# EAGLE design Qwiic Fuel Gauge - MAX17048 (EAGLE 9.6.2)
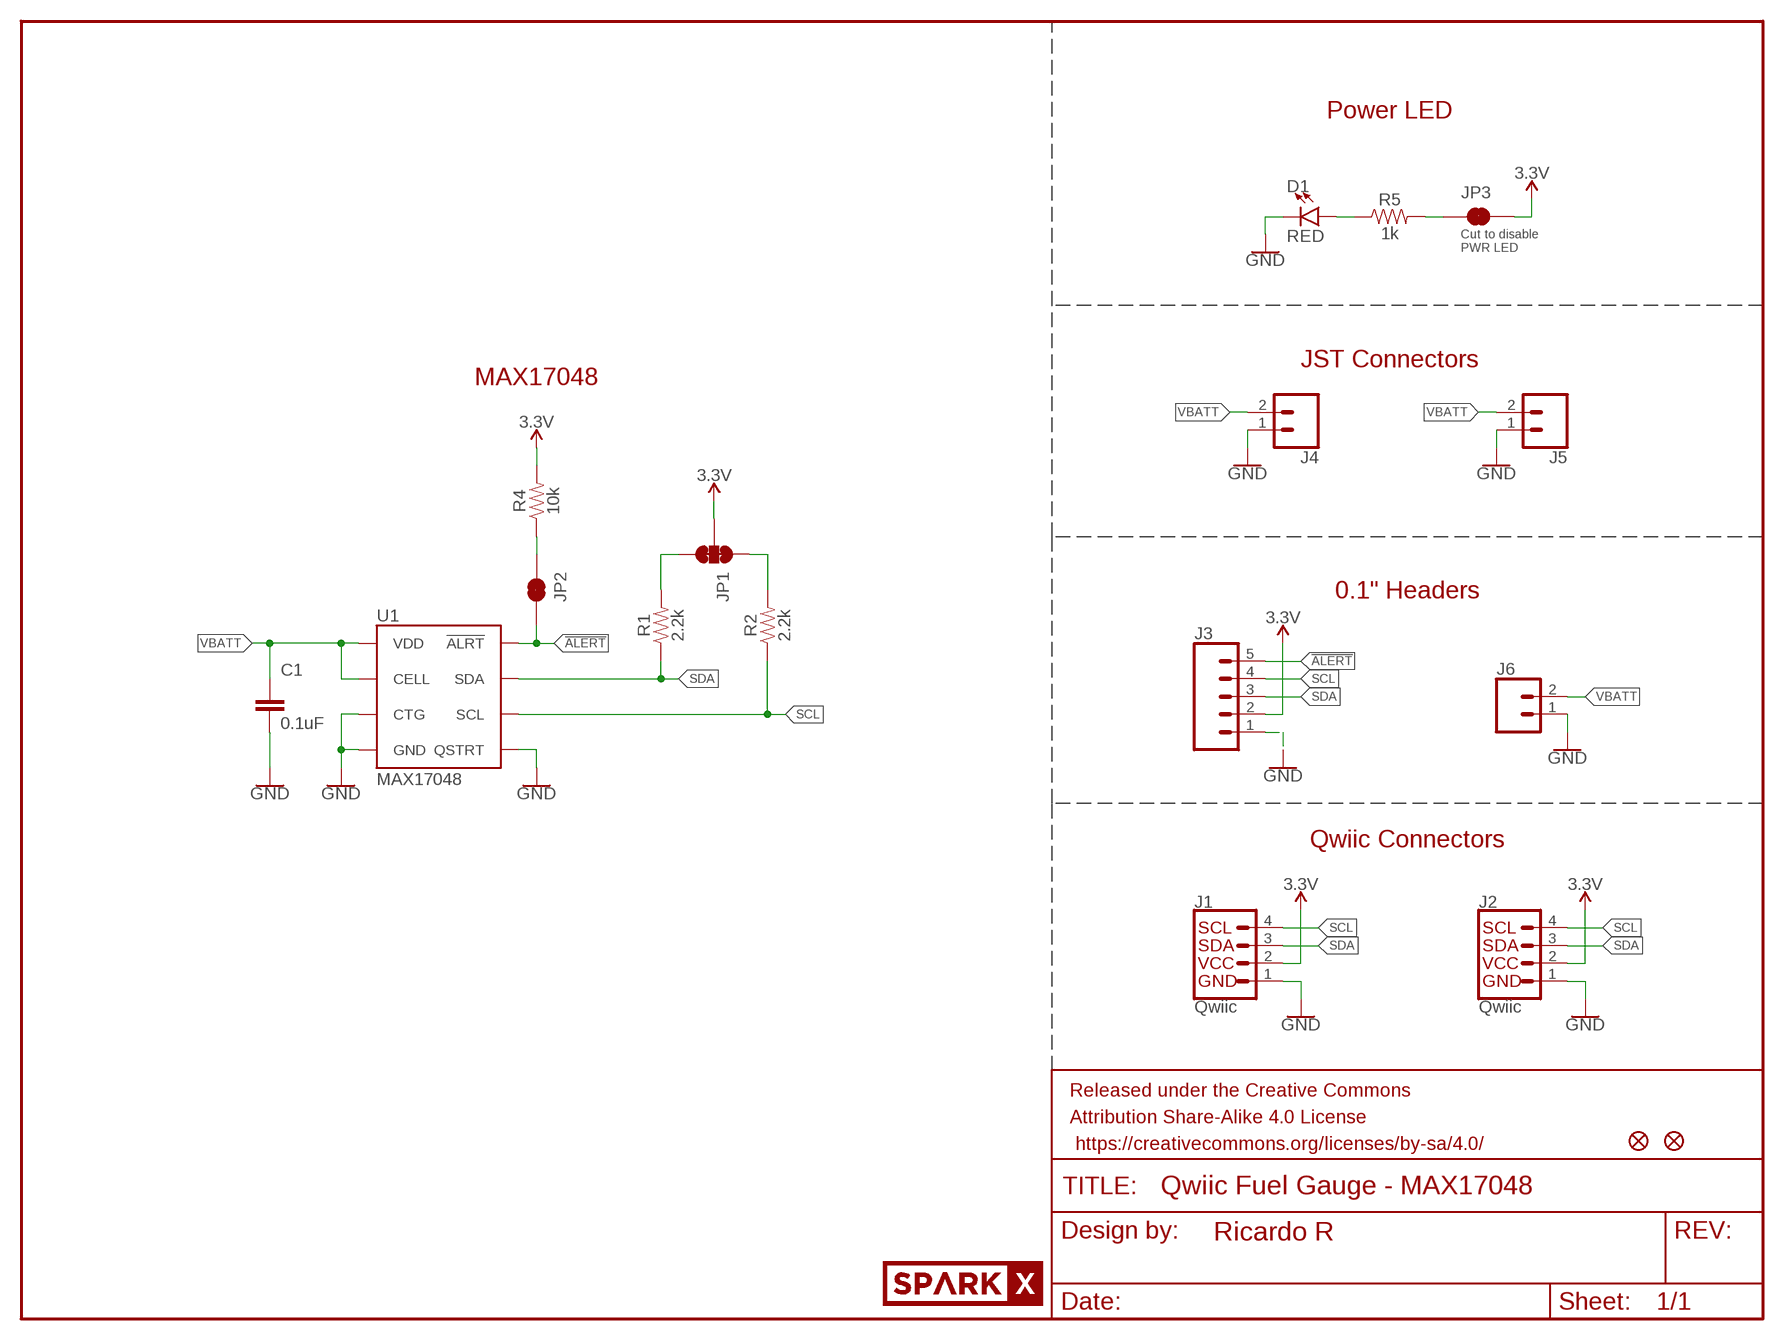
[diagram p0: schematic, sheet 1]

## Parts
C1  0.1uF  0.1UF-0603-25V-(+80/-20%)  [0603]
D1  RED  LED-RED0603  [LED-0603]
FD1  FIDUCIAL1X2  [FIDUCIAL-1X2]
FD2  FIDUCIAL1X2  [FIDUCIAL-1X2]
FRAME1  FRAME-LETTERNO_PACKAGE  [DUMMY]
J1  Qwiic  QWIIC_CONNECTORJS-1MM  [JST04_1MM_RA]
J2  Qwiic  QWIIC_CONNECTORJS-1MM  [JST04_1MM_RA]
J3  CONN_05NO_SILK  [1X05_NO_SILK]
J4  CONN_02-JST-2MM-SMT  [JST-2-SMD]
J5  CONN_02-JST-2MM-SMT  [JST-2-SMD]
J6  CONN_021X02_NO_SILK  [1X02_NO_SILK]
JP1  JUMPER-SMT_3_2-NC_TRACE_SILK  [SMT-JUMPER_3_2-NC_TRACE_SILK]
JP2  JUMPER-SMT_2_NC_TRACE_SILK  [SMT-JUMPER_2_NC_TRACE_SILK]
JP3  JUMPER-SMT_2_NC_TRACE_SILK  [SMT-JUMPER_2_NC_TRACE_SILK]
R1  2.2k  2.2KOHM-0603-1/10W-1%  [0603]
R2  2.2k  2.2KOHM-0603-1/10W-1%  [0603]
R4  10k  10KOHM-0603-1/10W-1%  [0603]
R5  1k  1KOHM-0603-1/10W-1%  [0603]
U1  MAX17048  MAX17048DFN8  [DFN-8]
U$30  SPARKX-LOGO4  [SPARKX-MEDIUM]

## Nets
3.3V: J1.2 J2.2 J3.2 JP1.2 JP3.2 R4.2
!ALERT: J3.5 JP2.2 U1.5(!ALRT)
GND: C1.2 D1.C J1.1 J2.1 J3.1 J4.1 J5.1 J6.1 U1.1(CTG) U1.4(GND) U1.6(QSTRT) U1.9(GND)
N$1: D1.A R5.1
N$2: JP1.3 R1.2
N$3: JP1.1 R2.2
N$4: JP3.1 R5.2
N$5: JP2.1 R4.1
SCL: J1.4 J2.4 J3.4 R2.1 U1.7(SCL)
SDA: J1.3 J2.3 J3.3 R1.1 U1.8(SDA)
VBATT: C1.1 J4.2 J5.2 J6.2 U1.2(CELL) U1.3(VDD)

## Notes on the sheet
- Power LED
- Cut to disable
  PWR LED
- JST Connectors
- MAX17048
- 0.1" Headers
- Qwiic Connectors

## Library data of the parts
C1 = SparkFun-Capacitors:0.1UF: 0.1µF ceramic capacitors A capacitor is a passive two-terminal electrical component used to store electrical energy temporarily in an electric field.; PROD_ID: CAP-00810
D1 = SparkFun-LED:LED-RED: Red SMD LED Used in manufacturing of most products at SparkFun Packages: 0603 - SMD 0603 package [Product Link] <http://docs.avagotech.com/docs/AV02-0551EN> 0603 SMART - SMD 0603 SMART package ( more efficient and expensive)[Product Link] <http://www.osram-os.com/Graphics/XPic2/00077099_0.pdf> 1206 - SMD1206 package [Product Link] <https://www.sparkfun.com/datasheets/DevTools/LilyPad/Q150OVS4.pdff> SparkFun Products: Pro Mini 328 -5V <https://www.sparkfun.com/products/821> RedBoard <https://www.sparkfun.com/products/12757> IOIO-OTG <https://www.sparkfun.com/products/13613>; PROD_ID: DIO-00819
FD1 FD2 = SparkFun-Aesthetics:FIDUCIAL: Fiducial Alignment Points Point-of-reference for pick-and-place machines and other optical instruments.
FRAME1 = SparkFun-Aesthetics:FRAME-LETTER: Schematic Frame - Letter Standard 8.5x11 US Letter frame; DESIGNER: Ricardo R; VERSION: v01
J1 J2 = SparkFun-Connectors:QWIIC_CONNECTOR: SparkFun I2C Standard Qwiic Connector An SMD 1mm pitch JST connector makes it easy and quick (get it? Qwiic?) to connect I2C devices to each other. The Qwiic system <http://www.sparkfun.com/qwiic> enables fast and solderless connection between popular platforms and various sensors and actuators. We carry 200mm <https://www.sparkfun.com/products/14204>, 100mm <https://www.sparkfun.com/products/14205>, 50mm <https://www.sparkfun.com/products/14206>, and breadboard friendly <https://www.sparkfun.com/products/14207> Qwiic cables. We also offer 10 pcs strips <https://www.sparkfun.com/products/14323> the SMD connectors.; PROD_ID: CONN-13694; VALUE: QWIIC_RIGHT_ANGLE
J3 = SparkFun-Connectors:CONN_05: Multi connection point. Often used as Generic Header-pin footprint for 0.1 inch spaced/style header connections On any of the 0.1 inch spaced packages, you can populate with these: Break Away Headers - Straight <https://www.sparkfun.com/products/116> (PRT-00116) Break Away Male Headers - Right Angle <https://www.sparkfun.com/products/553> (PRT-00553) Female Headers <https://www.sparkfun.com/products/115> (PRT-00115) Break Away Headers - Machine Pin <https://www.sparkfun.com/products/117> (PRT-00117) Break Away Female Headers - Swiss Machine Pin <https://www.sparkfun.com/products/743> (PRT-00743) For SCREWTERMINALS and SPRING TERMINALS visit here: Screw Terimnals on SparkFun.com <https://www.sparkfun.com/search/results?term=Screw+Terminals> (5mm/3.5mm/2.54mm spacing) This device is also useful as a general connection point to wire up your design to another part of your project. Our various solder wires solder well into these plated through hole pads. Hook-Up Wire - Assortment (Stranded, 22 AWG) <https://www.sparkfun.com/products/11375> (PRT-11375) Hook-Up Wire - Assortment (Solid Core, 22 AWG) <https://www.sparkfun.com/products/11367> (PRT-11367) View the entire wire category on our website here <https://www.sparkfun.com/categories/141> Special notes: Molex polarized connector foot print use with SKU : PRT-08231 with associated crimp pins and housings. 1MM SMD Version SKU: PRT-10208
J4 J5 = SparkFun-Connectors:CONN_02: Multi connection point. Often used as Generic Header-pin footprint for 0.1 inch spaced/style header connections On any of the 0.1 inch spaced packages, you can populate with these: Break Away Headers - Straight <https://www.sparkfun.com/products/116> (PRT-00116) Break Away Male Headers - Right Angle <https://www.sparkfun.com/products/553> (PRT-00553) Female Headers <https://www.sparkfun.com/products/115> (PRT-00115) Break Away Headers - Machine Pin <https://www.sparkfun.com/products/117> (PRT-00117) Break Away Female Headers - Swiss Machine Pin <https://www.sparkfun.com/products/743> (PRT-00743) For SCREWTERMINALS and SPRING TERMINALS visit here: Screw Terimnals on SparkFun.com <https://www.sparkfun.com/search/results?term=Screw+Terminals> (5mm/3.5mm/2.54mm spacing) This device is also useful as a general connection point to wire up your design to another part of your project. Our various solder wires solder well into these plated through hole pads. Hook-Up Wire - Assortment (Stranded, 22 AWG) <https://www.sparkfun.com/products/11375> (PRT-11375) Hook-Up Wire - Assortment (Solid Core, 22 AWG) <https://www.sparkfun.com/products/11367> (PRT-11367) View the entire wire category on our website here <https://www.sparkfun.com/categories/141> Special notes: Molex polarized connector foot print use with: PRT-08233 with associated crimp pins and housings. 2.54_SCREWTERM for use with PRT-10571. 3.5mm Screw Terminal footprints for PRT-08084 5mm Screw Terminal footprints for use with PRT-08432; PROD_ID: CONN-11443
J6 = SparkFun-Connectors:CONN_02: Multi connection point. Often used as Generic Header-pin footprint for 0.1 inch spaced/style header connections On any of the 0.1 inch spaced packages, you can populate with these: Break Away Headers - Straight <https://www.sparkfun.com/products/116> (PRT-00116) Break Away Male Headers - Right Angle <https://www.sparkfun.com/products/553> (PRT-00553) Female Headers <https://www.sparkfun.com/products/115> (PRT-00115) Break Away Headers - Machine Pin <https://www.sparkfun.com/products/117> (PRT-00117) Break Away Female Headers - Swiss Machine Pin <https://www.sparkfun.com/products/743> (PRT-00743) For SCREWTERMINALS and SPRING TERMINALS visit here: Screw Terimnals on SparkFun.com <https://www.sparkfun.com/search/results?term=Screw+Terminals> (5mm/3.5mm/2.54mm spacing) This device is also useful as a general connection point to wire up your design to another part of your project. Our various solder wires solder well into these plated through hole pads. Hook-Up Wire - Assortment (Stranded, 22 AWG) <https://www.sparkfun.com/products/11375> (PRT-11375) Hook-Up Wire - Assortment (Solid Core, 22 AWG) <https://www.sparkfun.com/products/11367> (PRT-11367) View the entire wire category on our website here <https://www.sparkfun.com/categories/141> Special notes: Molex polarized connector foot print use with: PRT-08233 with associated crimp pins and housings. 2.54_SCREWTERM for use with PRT-10571. 3.5mm Screw Terminal footprints for PRT-08084 5mm Screw Terminal footprints for use with PRT-08432
JP1 = SparkFun-Jumpers:JUMPER-SMT_3_2-NC_TRACE: Normally closed trace jumper (2 of 2 connections) This jumper has a trace between all three pads so they are normally closed (NC). Use a razor knife to open the connection(s). For best results follow the IPC guidelines for cutting traces: Cutout at least 0.063 mm (0.005 in). Remove all loose material to clean up the cut area. Seal the cut with an approved epoxy. Reapply solder to reclose the connection(s).
JP2 JP3 = SparkFun-Jumpers:JUMPER-SMT_2_NC_TRACE: Normally closed trace jumper This jumper has a trace between two pads so it's normally closed (NC). Use a razor knife to open the connection. For best results follow the IPC guidelines for cutting traces: Cutout at least 0.063 mm (0.005 in). Remove all loose material to clean up the cut area. Seal the cut with an approved epoxy. Reapply solder to reclose the connection.
R1 R2 = SparkFun-Resistors:2.2KOHM: 2.2kΩ resistor A resistor is a passive two-terminal electrical component that implements electrical resistance as a circuit element. Resistors act to reduce current flow, and, at the same time, act to lower voltage levels within circuits. - Wikipedia; PROD_ID: RES-08272
R4 = SparkFun-Resistors:10KOHM: 10kΩ resistor A resistor is a passive two-terminal electrical component that implements electrical resistance as a circuit element. Resistors act to reduce current flow, and, at the same time, act to lower voltage levels within circuits. - Wikipedia; PROD_ID: RES-00824
R5 = SparkFun-Resistors:1KOHM: 1kΩ resistor A resistor is a passive two-terminal electrical component that implements electrical resistance as a circuit element. Resistors act to reduce current flow, and, at the same time, act to lower voltage levels within circuits. - Wikipedia; PROD_ID: RES-07856
U1 = SparkFun-IC-Power:MAX17048: Micropower 1-Cell Li+ ModelGauge SparkFun Products Qduino Mini <https://www.sparkfun.com/products/13614> (DEV-13614); PROD_ID: IC-12551
U$30 = SparkX:SPARKX-LOGO

## Board
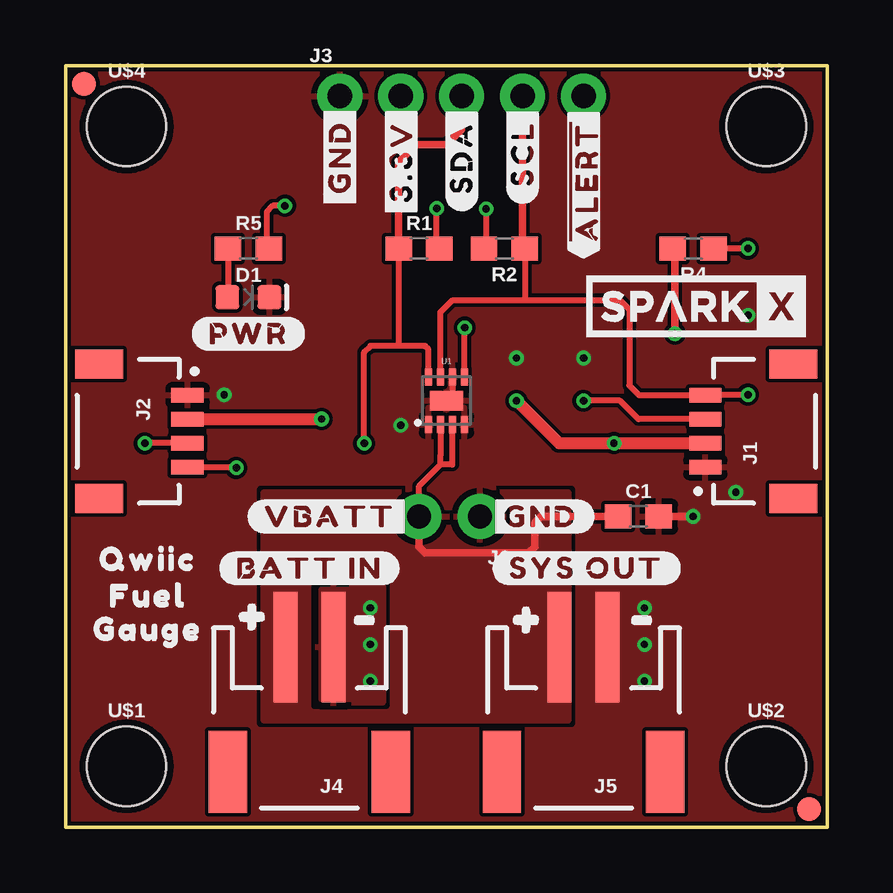
[diagram p1: board, top side]
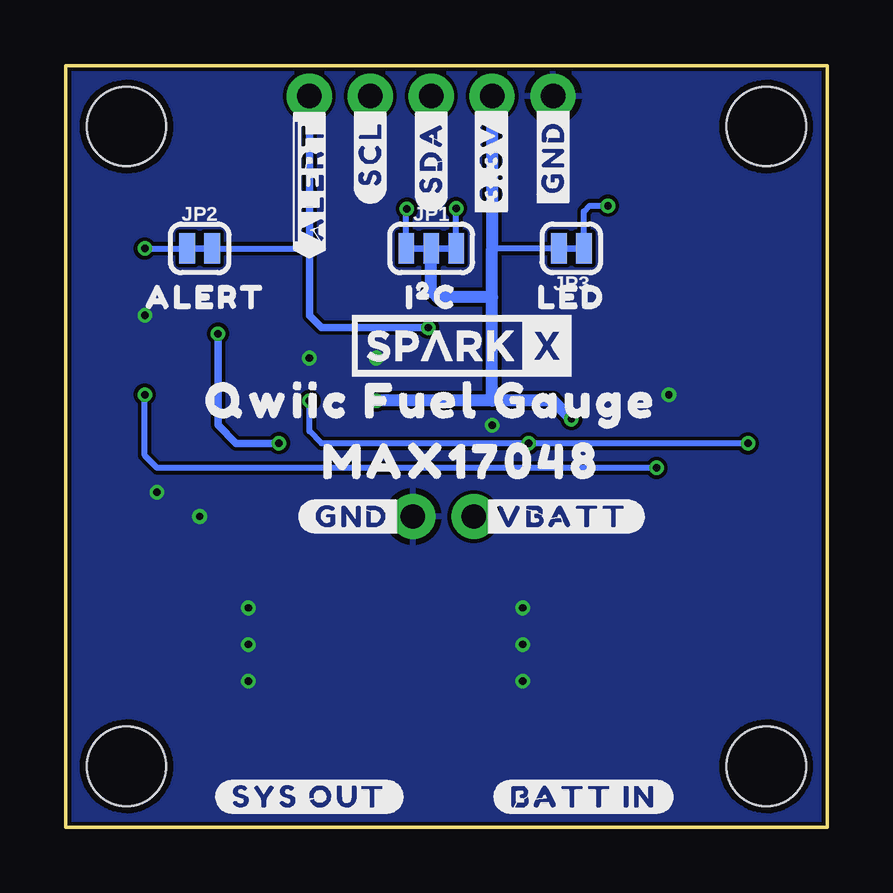
[diagram p2: board, bottom side, seen from below]

Size 31.75 x 31.75 mm. Coordinates in mm from the lower left corner, seen from the top.
Outline: 0,31.75 31.75,31.75 31.75,0 0,0 0,31.75
Copper layers (1*16): Top 0.035mm / dielectric 1.5mm / Bottom 0.035mm
Design rules "SparkFun-2-layer-PCBWay-LIMIT": minimum track width 6mil, minimum drill 0.3mm, track to track 6mil, track to pad 6mil, pad to pad 6mil, via to via 6mil, smd to smd 6mil, copper to edge 6mil, drill to drill 6mil, minimum pad ring 6mil, minimum via ring 6mil, stop-mask expansion 4mil, vias tented up to drill 25mil, thermal gap 10mil

### Footprints (pad centres in the part's own frame; a part is rotated, then mirrored left to right if it is on the bottom)
0603 = smd 1.1 x 1: 1 -0.85,0; 2 0.85,0
LED-0603 = smd 1 x 1: A -0.877,0; C 0.877,0
FIDUCIAL-1X2 = smd 1 x 1: 1 0,0
JST04_1MM_RA = smd 0.6 x 1.35: 1 -1.5,0; 2 -0.5,0; 3 0.5,0; 4 1.5,0 | smd 1.2 x 2: NC1 2.8,-3.675; NC2 -2.8,-3.675
1X05_NO_SILK = drill 1.016 pad 1.88: 1 0,0; 2 2.54,0; 3 5.08,0; 4 7.62,0; 5 10.16,0
JST-2-SMD = smd 1 x 4.6: 1 -1,-3.7; 2 1,-3.7 | smd 1.6 x 3.4: NC1 -3.4,1.5; NC2 3.4,1.5
1X02_NO_SILK = drill 1.016 pad 1.88: 1 0,0; 2 2.54,0
SMT-JUMPER_3_2-NC_TRACE_SILK = smd 0.66 x 1.27: 1 -1.041,0; 2 0,0; 3 1.041,0
SMT-JUMPER_2_NC_TRACE_SILK = smd 0.66 x 1.27: 1 -0.521,0; 2 0.521,0
DFN-8 = smd 0.3 x 0.7: 1 -0.75,-0.99; 2 -0.25,-0.99; 3 0.25,-0.99; 4 0.75,-0.99; 5 0.75,0.99; 6 0.25,0.99; 7 -0.25,0.99; 8 -0.75,0.99 | smd 1.38 x 0.8: 9 0,0
STAND-OFF = hole 3.302: 0,0

### Placement (x,y rotation side)
C1  23.88,12.95 0 top
D1  7.62,22.1 0 top
FD1  30.99,0.76 0 top
FD2  0.76,30.99 0 top
FRAME1  0,0 0 top
J1  26.67,16.51 90 top
J2  5.08,16.51 270 top
J3  11.43,30.48 0 top
J4  10.16,3.81 180 top
J5  21.59,3.81 180 top
J6  17.27,12.95 180 top
JP1  16.51,24.13 0 bottom
JP2  26.16,24.13 0 bottom
JP3  10.67,24.13 180 bottom
R1  14.73,24.13 0 top
R2  18.29,24.13 180 top
R4  26.16,24.13 180 top
R5  7.62,24.13 0 top
U1  15.88,17.78 0 top
U$1  [STAND-OFF]  2.54,2.54 0 top
U$2  [STAND-OFF]  29.21,2.54 0 top
U$3  [STAND-OFF]  29.21,29.21 0 top
U$4  [STAND-OFF]  2.54,29.21 0 top
U$5  [##ALERT##6]  21.59,23.72 90 top
U$6  [#SCL#5]  19.05,26.01 90 top
U$7  [#SDA#4]  16.51,25.7 90 top
U$8  [#3#3V#1]  14,25.32 90 top
U$9  [#GND#0]  11.43,25.7 90 top
U$10  [#BATT_IN#8]  10.16,10.79 0 top
U$11  [#SYS_OUT#0]  21.59,1.27 0 bottom
U$12  [#VBATT#10]  7.59,12.95 0 top
U$13  [#GND#7]  17.58,12.95 0 top
U$14  [#3#3V#1]  14,25.32 90 bottom
U$15  [#GND#0]  11.43,25.7 90 bottom
U$16  [##ALERT##6]  21.59,23.72 90 bottom
U$17  [#SCL#5]  19.05,26.01 90 bottom
U$18  [#GND#1708416]  22.05,12.95 0 bottom
U$19  [#VBATT#1708415]  14.48,12.95 0 bottom
U$20  [#BATT_IN#8]  10.16,1.27 0 bottom
U$21  SPARKX-LOGO4  [SPARKX-MEDIUM]  15.24,20.07 0 bottom
U$22  [#SDA#4]  16.51,25.7 90 bottom
U$23  [MAX170481]  15.24,15.24 0 bottom
U$24  [FUEL1]  3.43,9.65 0 top
U$25  [ALERT1708413]  25.91,22.1 0 bottom
U$26  [#PWR#1708412]  7.62,20.57 0 top
U$27  [QWIIC_FUEL_GAUGE0]  16.51,17.78 0 bottom
U$28  [I�C0]  16.51,22.1 0 bottom
U$29  [LED1]  10.67,22.1 0 bottom
U$30  26.29,21.72 0 top
U$31  [GAUGE2]  3.43,8.26 0 top
U$32  [QWIIC0]  3.43,11.18 0 top
U$33  [#0]  7.87,8.76 0 top
U$34  [#0]  19.3,8.64 0 top
U$35  [#1]  12.57,8.64 0 top
U$36  [#1]  24.13,8.64 0 top
U$37  [#SYS_OUT#0]  21.72,10.79 0 top

### Tracks (layer width: path | path; a pad name or v marks a point on that pad's centre or on a via)
3.3V  (via drill 0.3)
  Top 0.305: R4.2 25.4,24.04 v25.4,20.57
  Top 0.508: J2.2 v10.66,17.01 v10.67,17.02 | v18.8,17.78 20.57,16.01 v22.86,16.01 J1.2
  Bottom 0.254: JP3.2 13.97,24.13
  Bottom 0.305: v25.4,20.57 25.4,16.76 24.64,16 v22.87,16 v22.86,16.01
  Bottom 0.508: v10.67,17.02 11.43,17.78 13.97,17.78 | 13.97,17.78 v18.8,17.78 | J3.2 13.97,24.13 13.97,22.1 | 13.97,17.78 13.97,22.1 | 13.97,22.1 16.26,22.1 16.51,22.35 JP1.2
!ALERT  (via drill 0.3)
  Top 0.254: U1.5 16.62,20.82 v16.64,20.83
  Bottom 0.254: JP2.2 21.59,24.13
  Bottom 0.305: v16.64,20.83 21.08,20.83 21.59,21.34 21.59,24.13 J3.5
GND  (via drill 0.3)
  Top 0.254: U1.6 16.12,18.03 U1.9
  Top 0.305: C1.2 v26.16,12.95
  other vias: 28.45,21.34 18.8,19.56 21.59,19.56 12.7,9.14 12.7,7.62 12.7,6.1 24.13,9.14 24.13,7.62 24.13,6.1 6.6,18.03 13.97,16.76 27.94,13.97
  pour Top (isolate 0.305, no thermals): 10.67,9.91 13.08,9.91 13.08,5.33 10.67,5.33
  pour Top (isolate 0.305, rank 3, no thermals): 21.84,4.95 24.64,4.95 24.64,10.16 21.84,10.16
  pour Top (rank 3): 0,31.75 31.75,31.75 31.75,0 0,0
  pour Bottom (rank 3): 0,31.75 31.75,31.75 31.75,0 0,0
N$1
  Top 0.254: R5.1 6.77,22.12 D1.A
N$2  (via drill 0.3)
  Top 0.254: 15.47,24.24 v15.47,25.81
  Top 0.305: R1.2 15.47,24.24
  Bottom 0.254: JP1.3 v15.47,25.81
N$3  (via drill 0.3)
  Top 0.254: v17.53,25.78 17.53,24.22 R2.2
  Bottom 0.254: JP1.1 17.55,25.78 v17.53,25.78
N$4  (via drill 0.3)
  Top 0.254: v9.14,25.91 8.64,25.91 8.38,25.65 8.38,24.22 R5.2
  Bottom 0.254: JP3.1 10.15,25.67 9.91,25.91 v9.14,25.91
N$5  (via drill 0.3)
  Top 0.254: v28.45,24.13 R4.1
  Bottom 0.254: v28.45,24.13 JP2.1
SCL  (via drill 0.3)
  Top 0.254: U1.7 15.62,21.47 16.13,21.97 19.13,21.97 | 19.13,21.97 23.11,21.97 23.5,21.59 23.5,18.41 23.9,18.01 J1.4 28.42,18.01 v28.45,18.03 | J2.4 7.09,15.01 v7.11,14.99 | R2.1 19.14,21.98 19.13,21.97
  Top 0.305: J3.4 19.05,24.22 R2.1
  Bottom 0.254: v7.11,14.99 27.94,14.99 28.45,15.49 v28.45,18.03
SDA  (via drill 0.3)
  Top 0.254: J2.3 v3.31,16.01 v3.3,16 | v12.45,16 12.45,19.81 12.7,20.07 13.84,20.07 | U1.8 15.12,19.93 14.99,20.07 13.84,20.07 | R1.1 13.88,20.11 13.84,20.07 | J1.3 23.88,17.01 23.11,17.78 v21.59,17.78
  Top 0.305: J3.3 16.51,29.08 15.88,28.45 14.61,28.45 13.88,27.73 R1.1
  Bottom 0.254: v3.3,16 v12.45,16 21.08,16 21.59,16.51 v21.59,17.78
VBATT
  Top 0.254: U1.2 15.62,15.49 15.62,15.12 | 15.62,15.12 15.62,15.11 16.12,15.11 U1.3 | 15.62,15.12 14.73,14.22 J6.2
  Top 0.305: J6.2 14.73,11.68 14.99,11.43 19.3,11.43 19.56,11.68 19.56,12.7 19.81,12.95 C1.1
  pour Top (isolate 0.305, rank 2, no thermals): 8.26,10.79 20.95,10.79 20.95,4.45 8.26,4.45
  pour Top (isolate 0.305, rank 2): 8.26,10.79 8.26,13.97 20.95,13.97 20.95,10.79